# EasyEDA Pro project ProDoc_PCB1_3_2026-04-01.epro

# Board PCB1_3
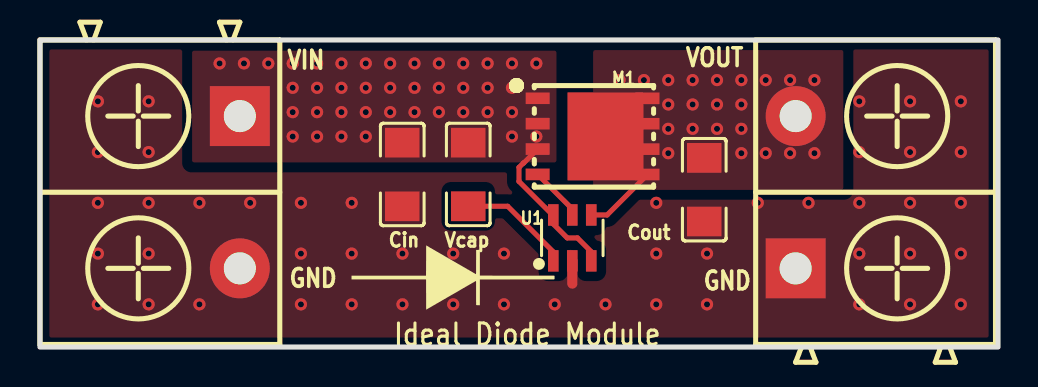
[diagram p0: board, top side]
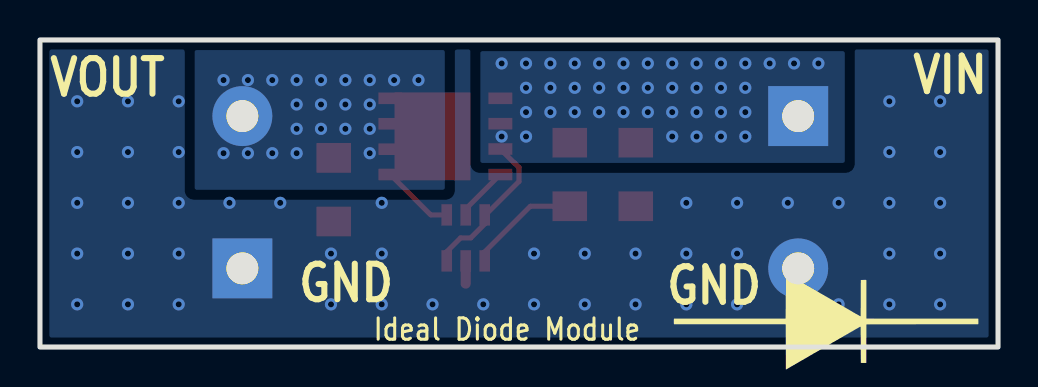
[diagram p1: board, bottom side, seen from below]

Outline 47.94 x 15.37 mm; copper layers: Top Layer, Bottom Layer. Coordinates in mm from the lower left corner of the outline.
Outline path: rectangle 0,15.37 47.94,0
Stack: Top Layer 0.035mm / Dielectric1 1.51mm FR4 er 4.5 / Bottom Layer 0.035mm

## Design rules (mm)
template: Custom Config
spacing copperThickness1oz (default): track to track 0.102, other pairs 0.152 to 0.3
spacing copperThickness2oz: track to track 0.203, other pairs 0.152 to 0.3
track width copperThickness1oz (default): min 0.127, default 0.254, max 2.54
track width copperThickness2oz: min 0.203, default 0.254, max 2.54
differential pair differentialPair (default): width min 0.127, default 0.254, max 2.54; gap min 0.152, default 0.152
via viaSize (default): diameter min 0.5, default 0.61, max 10; hole min 0.3, default 0.305, max 6.3
net VIN uses highcurrent
net VOUT uses highcurrent
net GND uses highcurrent

## Placement (name value [footprint] x y rotation side)
Cin  220nF  [C1206]  18.13 8.64 270 top
Cout  220nF  [C1206]  33.24 7.87 270 top
IN  KF7.62-2P(green)  [CONN-TH_2P-P7.62_KEFA_KF7.62-2P]  10 7.75 270 top
M1  AGM403A1  [DFN-8_L5.8-W4.9-P1.27-LS6.0-BL-1]  27.65 10.54 270 top
OUT  KF7.62-2P(green)  [CONN-TH_2P-P7.62_KEFA_KF7.62-2P]  37.81 7.75 90 top
U1  LM74700QDBVRQ1  [SOT-23-6_L2.9-W1.6-P0.95-LS2.8-BL]  26.64 5.46 0 top
Vcap  220nF  [C1206]  21.43 8.64 270 top

## Footprints (pads in the part's own frame, mm; a bottom-side part is the same pattern mirrored in y, then rotated)
C1206
  rect 1.485x1.728 smd: 1(-1.593,0) 2(1.593,0)
CONN-TH_2P-P7.62_KEFA_KF7.62-2P
  rect 3x3 hole 1.6: 1(-3.81,0)
  round 3 hole 1.6: 2(3.81,0)
DFN-8_L5.8-W4.9-P1.27-LS6.0-BL-1
  rect 0.58x1.2 smd: 1(-1.907,-2.75) 2(-0.637,-2.75) 3(0.632,-2.75) 4(1.903,-2.75) 5(1.907,2.75) 6(0.637,2.75) 7(-0.632,2.75) 8(-1.903,2.75)
  rect 4.4x3.8 smd: 9(0,0.646)
SOT-23-6_L2.9-W1.6-P0.95-LS2.8-BL
  rect 0.532x1.072 smd: 1(-0.95,-1.149) 2(0,-1.149) 3(0.95,-1.149) 4(0.95,1.149) 5(0,1.149) 6(-0.95,1.149)

## Nets
GND: Cin.2 Cout.2 IN.2 OUT.1 U1.2
VIN: Cin.1 IN.1 M1.1 M1.2 M1.3 U1.3 U1.6 Vcap.1
VOUT: Cout.1 M1.5 M1.6 M1.7 M1.8 M1.9 OUT.2 U1.4
$1N889: M1.4 U1.5
$1N950: U1.1 Vcap.2

## Via types
v1: diameter 0.61, hole 0.305, Top Layer to Bottom Layer, 111 vias

## Routing (per net, layer and track width the routed paths; a pad name or vN(x,y) marks a point on that pad's centre or on a via; arc(x,y) is an arc through that point)
GND: length 1.1
  Top Layer w0.508: U1.2 26.64,3.17
  vias: v1(2.9,12.3) v1(2.9,9.76) v1(2.9,7.22) v1(2.9,4.68) v1(2.9,2.14) v1(5.44,12.3) v1(5.44,9.76) v1(5.44,7.22) v1(5.44,4.68) v1(5.44,2.14) v1(7.98,7.22) v1(7.98,2.14) v1(10.52,7.22) v1(13.06,7.22) v1(13.06,4.68) v1(13.06,2.14) v1(15.6,7.22) v1(15.6,4.68) v1(15.6,2.14) v1(18.14,4.68) v1(18.14,2.14) v1(20.68,4.68) v1(20.68,2.14) v1(23.22,4.68) v1(23.22,2.14) v1(25.76,2.14) v1(28.3,2.14) v1(30.84,7.22) v1(30.84,4.68) v1(30.84,2.14) v1(33.38,4.68) v1(33.38,2.14) v1(35.92,7.22) v1(38.46,7.22) v1(41,12.3) v1(41,9.76) v1(41,7.22) v1(41,4.68) v1(41,2.14) v1(43.54,12.3) v1(43.54,9.76) v1(43.54,7.22) v1(43.54,4.68) v1(43.54,2.14) v1(46.08,12.3) v1(46.08,9.76) v1(46.08,7.22) v1(46.08,4.68) v1(46.08,2.14)
VIN: length 7.8
  Top Layer w0.254: M1.3 24.2,9.21 24.19,9.21 23.97,8.99 23.97,8.29 25.65,6.61 U1.6 25.69,6.16 26.38,5.46 26.89,5.46 27.59,4.77 U1.3
  vias: v1(8.99,14.19) v1(10.21,14.19) v1(11.43,14.19) v1(12.65,14.19) v1(12.65,12.97) v1(12.65,11.75) v1(12.65,10.53) v1(13.87,14.19) v1(13.87,12.97) v1(13.87,11.75) v1(13.87,10.53) v1(15.08,14.19) v1(15.08,12.97) v1(15.08,11.75) v1(15.08,10.53) v1(16.3,14.19) v1(16.3,12.97) v1(16.3,11.75) v1(16.3,10.53) v1(17.52,14.19) v1(17.52,12.97) v1(17.52,11.75) v1(18.74,14.19) v1(18.74,12.97) v1(18.74,11.75) v1(19.96,14.19) v1(19.96,12.97) v1(19.96,11.75) v1(21.18,14.19) v1(21.18,12.97) v1(21.18,11.75) v1(22.4,14.19) v1(22.4,12.97) v1(22.4,11.75) v1(23.62,14.19) v1(23.62,12.97) v1(23.62,11.75) v1(23.62,10.53) v1(24.84,14.19) v1(24.84,10.53)
VOUT: length 3.7
  Top Layer w0.254: U1.4 28.38,6.61 M1.5
  vias: v1(29,13.36) v1(30.22,13.36) v1(31.44,13.36) v1(31.44,12.14) v1(31.44,10.92) v1(31.44,9.7) v1(32.66,13.36) v1(32.66,12.14) v1(32.66,10.92) v1(33.88,13.36) v1(33.88,12.14) v1(33.88,10.92) v1(35.1,13.36) v1(35.1,12.14) v1(35.1,10.92) v1(35.1,9.7) v1(36.32,13.36) v1(36.32,9.7) v1(37.54,13.36) v1(37.54,9.7) v1(38.75,13.36) v1(38.75,9.7)
$1N889: length 2.7
  Top Layer w0.254: U1.5 26.64,6.9 M1.4
$1N950: length 5.7
  Top Layer w0.254: U1.1 25.69,4.76 23.4,7.04 Vcap.2

## Copper pours and planes (outline as drawn; the poured copper is in the pictures)
GND on Top Layer: 0,15.37 47.72,15.37 47.72,0 0,0
GND on Bottom Layer: -0.02,15.43 47.7,15.43 47.7,0.06 -0.02,0.06
VIN on Top Layer: 7.59,14.86 25.87,14.86 25.87,9.22 7.59,9.22
VIN on Bottom Layer: 7.64,14.83 25.93,14.83 25.93,9.19 7.64,9.19
VOUT on Top Layer: 27.65,14.89 40.23,14.89 40.23,7.85 27.65,7.85
VOUT on Bottom Layer: 27.65,14.89 40.23,14.89 40.23,7.85 27.65,7.85

## Text on the board
Bottom Silkscreen Layer: Ideal Diode Module | VIN | GND | VOUT
Top Silkscreen Layer: VIN | GND | VOUT | Ideal Diode Module
